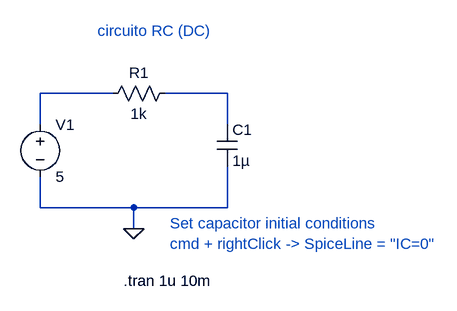
[diagram p0: schematic circuitoRCv2.asc]
circuitoRCv2.asc, the LTspice schematic file:
Version 4
SHEET 1 904 680
WIRE 400 240 288 240
WIRE 576 240 480 240
WIRE 288 288 288 240
WIRE 576 288 576 240
WIRE 288 416 288 368
WIRE 432 416 288 416
WIRE 576 416 576 352
WIRE 576 416 432 416
WIRE 432 448 432 416
FLAG 432 448 0
SYMBOL Voltage 288 272 R0
SYMATTR InstName V1
SYMATTR Value 5
SYMBOL Res 384 256 R270
WINDOW 0 32 56 VTop 2
WINDOW 3 0 56 VBottom 2
SYMATTR InstName R1
SYMATTR Value 1k
SYMBOL Cap 560 288 R0
SYMATTR InstName C1
SYMATTR Value 1µ
SYMATTR SpiceLine IC=0
TEXT 416 528 Left 2 !.tran 1u 10m
TEXT 376 144 Left 2 ;circuito RC (DC)
TEXT 488 440 Left 2 ;Set capacitor initial conditions\ncmd + rightClick -> SpiceLine = "IC=0"

The netlist it stands for:
* circuitoRCv2.asc
V1 N001 0 5
R1 N001 N002 1k
C1 N002 0 1µ IC=0
.tran 1u 10m
* circuito RC (DC)
* Set capacitor initial conditions
* cmd + rightClick -> SpiceLine = "IC=0"
.backanno
.end